# Altium schematic sheet Connectors_U_B.SchDoc
size A4; SheetNumber: 2; SheetTotal: 4
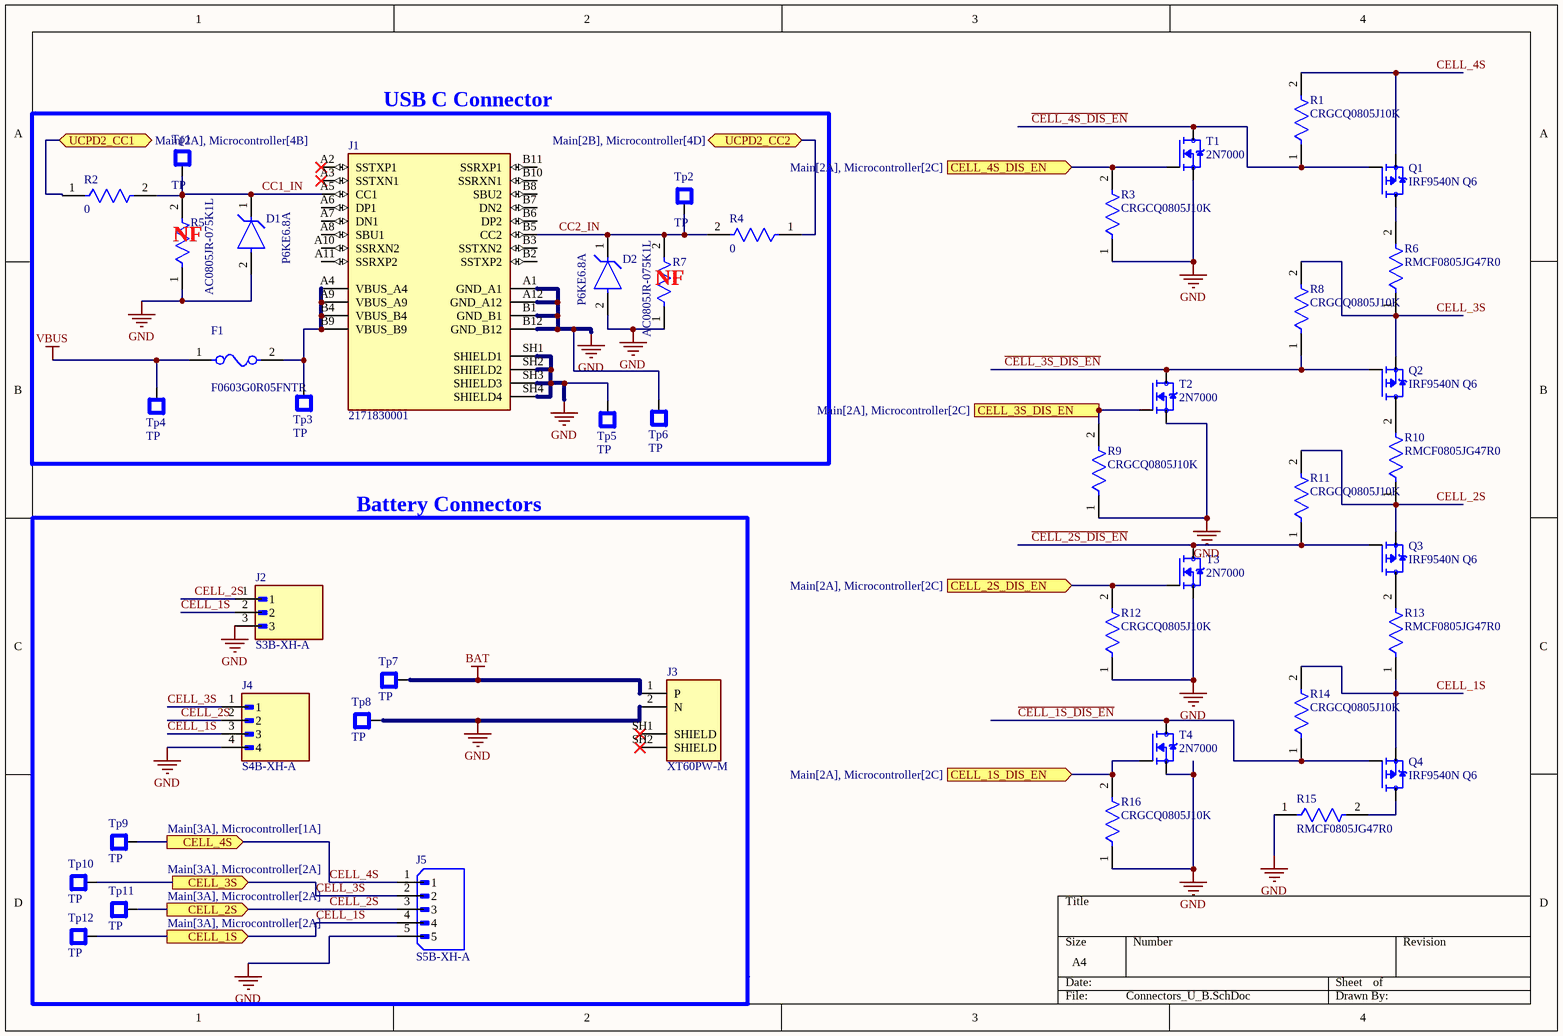
[diagram p0: Connectors_U_B.SchDoc]

## Parts
D1  P6KE6.8A  [FP-P6KE-MFG]
D2  P6KE6.8A  [FP-P6KE-MFG]
F1  F0603G0R05FNTR  [FP-F0603G-MFG]
J1  2171830001  [MOLEX_2171830001]
J2  S3B-XH-A  [JST_S3B-XH-A]
J3  XT60PW-M  [AMASS_XT60PW-M]
J4  S4B-XH-A  [JST_S4B-XH-A]
J5  S5B-XH-A  [JST_S5B-XH-A]
Q1  IRF9540N Q6  [TO254P1041X444X1930-3]
Q2  IRF9540N Q6  [TO254P1041X444X1930-3]
Q3  IRF9540N Q6  [TO254P1041X444X1930-3]
Q4  IRF9540N Q6  [TO254P1041X444X1930-3]
R1  CRGCQ0805J10K  [FP-CRGCQ0805-IPC_C]
R2  0  [FP-HCJ0805-MFG]
R3  CRGCQ0805J10K  [FP-CRGCQ0805-IPC_C]
R4  0  [FP-HCJ0805-MFG]
R5  AC0805JR-075K1L  [FP-AC0805-MFG]
R6  RMCF0805JG47R0  [FP-RMCF0805-MFG]
R7  AC0805JR-075K1L  [FP-AC0805-MFG]
R8  CRGCQ0805J10K  [FP-CRGCQ0805-IPC_C]
R9  CRGCQ0805J10K  [FP-CRGCQ0805-IPC_C]
R10  RMCF0805JG47R0  [FP-RMCF0805-MFG]
R11  CRGCQ0805J10K  [FP-CRGCQ0805-IPC_C]
R12  CRGCQ0805J10K  [FP-CRGCQ0805-IPC_C]
R13  RMCF0805JG47R0  [FP-RMCF0805-MFG]
R14  CRGCQ0805J10K  [FP-CRGCQ0805-IPC_C]
R15  RMCF0805JG47R0  [FP-RMCF0805-MFG]
R16  CRGCQ0805J10K  [FP-CRGCQ0805-IPC_C]
T1  2N7000  [TO92]
T2  2N7000  [TO92]
T3  2N7000  [TO92]
T4  2N7000  [TO92]
Tp1  TP  [Tp]
Tp2  TP  [Tp]
Tp3  TP  [Tp]
Tp4  TP  [Tp]
Tp5  TP  [Tp]
Tp6  TP  [Tp]
Tp7  TP  [Tp]
Tp8  TP  [Tp]
Tp9  TP  [Tp]
Tp10  TP  [Tp]
Tp11  TP  [Tp]
Tp12  TP  [Tp]

## Ports
CELL_1S (out, see Main[3A], Microcontroller[2A]), CELL_1S_DIS_EN (in, see Main[2A], Microcontroller[2C]), CELL_2S (out, see Main[3A], Microcontroller[2A]), CELL_2S_DIS_EN (in, see Main[2A], Microcontroller[2C]), CELL_3S (out, see Main[3A], Microcontroller[2A]), CELL_3S_DIS_EN (in, see Main[2A], Microcontroller[2C]), CELL_4S (out, see Main[3A], Microcontroller[1A]), CELL_4S_DIS_EN (in, see Main[2A], Microcontroller[2C]), UCPD2_CC1 (bidir, see Main[2A], Microcontroller[4B]), UCPD2_CC2 (bidir, see Main[2B], Microcontroller[4D])

## Nets
BAT: J3.1(P) Tp7.1
GND: D1.2(A) D2.2(A) J1.A1(GND_A1) J1.A12(GND_A12) J1.B1(GND_B1) J1.B12(GND_B12) J1.SH1(SHIELD1) J1.SH2(SHIELD2) J1.SH3(SHIELD3) J1.SH4(SHIELD4) J2.3 J3.2(N) J4.4 J5.5 R3.1 R5.1 R7.1 R9.1 R12.1 R15.1 R16.1 T1.1(S) T2.1(S) T3.1(S) T4.1(S) Tp5.1 Tp6.1 Tp8.1
VBUS: F1.1 Tp4.1
~{CELL_1S_DIS_EN}: Q4.1(G) R14.1 T4.3(D)
~{CELL_2S_DIS_EN}: Q3.1(G) R11.1 T3.3(D)
~{CELL_3S_DIS_EN}: Q2.1(G) R8.1 T2.3(D)
~{CELL_4S_DIS_EN}: Q1.1(G) R1.1 T1.3(D)
CC1_IN: D1.1(C) J1.A5(CC1) R2.2 R5.2 Tp1.1
CC2_IN: D2.1(C) J1.B5(CC2) R4.2 R7.2 Tp2.1
CELL_1S: J2.2 J4.3 J5.4 Q4.3(S) R13.1 R14.2 Tp12.1 ; port CELL_1S
CELL_1S_DIS_EN: R16.2 T4.2(G) ; port CELL_1S_DIS_EN
CELL_2S: J2.1 J4.2 J5.3 Q3.3(S) R10.1 R11.2 Tp11.1 ; port CELL_2S
CELL_2S_DIS_EN: R12.2 T3.2(G) ; port CELL_2S_DIS_EN
CELL_3S: J4.1 J5.2 Q2.3(S) R6.1 R8.2 Tp10.1 ; port CELL_3S
CELL_3S_DIS_EN: R9.2 T2.2(G) ; port CELL_3S_DIS_EN
CELL_4S: J5.1 Q1.3(S) R1.2 Tp9.1 ; port CELL_4S
CELL_4S_DIS_EN: R3.2 T1.2(G) ; port CELL_4S_DIS_EN
UCPD2_CC1: R2.1 ; port UCPD2_CC1
UCPD2_CC2: R4.1 ; port UCPD2_CC2
NetF1_2: F1.2 J1.A4(VBUS_A4) J1.A9(VBUS_A9) J1.B4(VBUS_B4) J1.B9(VBUS_B9) Tp3.1
NetQ1_2: Q1.2(D) R6.2
NetQ2_2: Q2.2(D) R10.2
NetQ3_2: Q3.2(D) R13.2
NetQ4_2: Q4.2(D) R15.2

Not connected (* = marked no-connect by the designer): J1 A2(SSTXP1)* A3(SSTXN1)* A6(DP1) A7(DN1) A8(SBU1) A10(SSRXN2) A11(SSRXP2) B2(SSTXP2) B3(SSTXN2) B6(DP2) B7(DN2) B8(SBU2) B10(SSRXN1) B11(SSRXP1); J3 SH1(SHIELD)* SH2(SHIELD)*

## Notes on the sheet
- USB C Connector
- (near R5) NF
- (near R7) NF
- Battery Connectors

## Library data of the parts
D1 D2 = CMP-08607-000072-1: TVS DIODE 5.8V 10.5V DO204AC; Manufacturer: Littelfuse Inc; Peak Pulse Power: 600W; Max Junction Temp: +175°C; Peak Pulse Current: 58.1A; Number Of Channels: 1; Direction: Unidirectional; Breakdown Voltage: 6.45V; Mouser Description: TVSS; Diode; For Data/Comm; Industrial Equip; 58.1A; Thru-Hole; Solder Term; Height: 3.6mm; RoHS: TRUE; Lead Free: Yes; Category: Diode; ComponentLink2Description: Datasheet; Manufacturer Part Number: P6KE6.8A; Package: P6KE; Temperature Range Low: -55°C; Device Class L3: unset; Digikey Description: TVS DIODE 5.8V 10.5V DO204AC; Temperature Range High: +175°C; Automotive: No; Clamping Voltage: 10.5V; Ipc Land Pattern Name: DIOPA1328W105L760D360; Octopart: https://octopart.com/p6ke6.8a-littelfuse-20808; ComponentLink2URL: https://www.littelfuse.com/~/media/electronics/datasheets/tvs_diodes/littelfuse_tvs_diode_p6ke_datasheet.pdf.pdf; Temperature: -55°C to +175°C; Device Class L2: TVS Diodes; Device Class L1: Circuit Protection; Reverse Standoff Voltage: 5.8V
F1 = CMP-04585-000004-1: FUSE BOARD MOUNT 50MA 32VDC 0603; Manufacturer: AVX Corporation; Voltage Rating: 32V; Fuse I2T: 0.000002A2Sec; Fuse Current: 0.125A; Fuse Voltage Drop: 250mV; Fuse Blow Speed: Fast; Value: 3.4Ω; ComponentLink2URL: http://datasheets.avx.com/AccuGuardLC_0603.pdf; Digikey Description: FUSE BOARD MOUNT 50MA 32VDC 0603; Lead Free: Yes; Temperature: -55°C to +125°C; Device Class L2: Fuses; Device Class L1: Circuit Protection; ComponentLink2Description: Datasheet; Category: Fuse; Package: F0603G; Height: 0.71mm; Mouser Description: Fuse Chip 0.05A 32V Fast 2-Pin Solder Pad Surface Mount T/R; Device Class L3: unset; Temperature Range High: +125°C; Temperature Range Low: -55°C; Octopart: https://octopart.com/f0603g0r05fntr-avx-21046321; Resistance: 3.4Ω; RoHS: TRUE; Manufacturer Part Number: F0603G0R05FNTR; Automotive: No
J1 = 2171830001: MF: {'manufacturer': u'Molex'}; Package: None; Price: None; Value: *; MP: 2171830001; Availability: Unavailable
J3 = XT60PW-M: Socket, DC supply, male, PIN: 2; MF: AMASS; SnapEDA_Link: https://www.snapeda.com/parts/XT60PW-M/AMASS/view-part/?ref=snap; Package: Package; Value: *; MP: XT60PW-M; Check_prices: https://www.snapeda.com/parts/XT60PW-M/AMASS/view-part/?ref=eda
J5 = S5B-XH-A: Connector Header Through Hole, Right Angle 5 position 0.098 (2.50mm); MF: JST Sales; SnapEDA_Link: https://www.snapeda.com/parts/S5B-XH-A/JST+Sales+America+Inc./view-part/?ref=snap; Package: None; Value: *; MP: S5B-XH-A; Check_prices: https://www.snapeda.com/parts/S5B-XH-A/JST+Sales+America+Inc./view-part/?ref=eda
Q1-Q4 = IRF9540N Q6: P-Channel 100 V 23A (Tc) 3.1W (Ta), 110W (Tc); MF: Infineon Technologies; Value: *; Purchase-URL: https://pricing.snapeda.com/search/part/IRF9540N/?ref=eda; Package: TO-220 Infineon; MP: IRF9540N; Check_prices: https://www.snapeda.com/parts/IRF9540N/Infineon+Technologies/view-part/?ref=eda; SnapEDA_Link: https://www.snapeda.com/parts/IRF9540N/Infineon+Technologies/view-part/?ref=snap; Price: None; Availability: In Stock
R1 R3 R8 R9 R11 R12 R14 R16 = CMP-03211-002989-1: CRGCQ 0805 10K 5%; Manufacturer: TE Connectivity; Voltage Rating: 150V; Temperature Coefficient: ±100ppm/°C; Resistance: 10KΩ; Value: 10KΩ; Power Rating: 0.125W; Tolerance: 0.05; Automotive Grade: Grade 914; Height: 0.65mm; Lead Free: Yes; Temperature Range High: +155°C; Composition: Thick Film; Temperature Range Low: -55°C; Ambient Temperature Range High: +70°C; Temperature: -55°C to +155°C; Package: CRGCQ0805; Device Class L2: Resistors; RoHS: TRUE; ComponentLink2URL: https://www.te.com/commerce/DocumentDelivery/DDEController?Action=showdoc&DocId=Data+Sheet%7F1773204-3%7F1%7Fpdf%7FEnglish%7FENG_DS_1773204-3_1.pdf%7F4-2176341-923; Manufacturer Part Number: CRGCQ0805J10K; Series: CRGCQ; Device Class L1: Passive Components; Ipc Land Pattern Name: RESC200125X55; ComponentLink2Description: Datasheet; Category: Res; Digikey Description: CRGCQ 0805 10K 5%; Mouser Description: Res Thick Film 0805 10K Ohm 5% 0.125W(1/8W) ±100ppm/C Pad SMD Automotive T/R; Automotive: Yes; Octopart: https://octopart.com/crgcq0805j10k-te+connectivity-91018201; Device Class L3: Chip SMD Resistors
R2 R4 = CMP-26527-000104-1: RES 0 OHM JUMPER 1/2W 0805; Resistance: 0mR; Radiation Hardening: No; Case Code (Imperial): 0805; Number of Terminations: 2; Lead Free: Lead Free; Max Operating Temperature: 155°C; Width: 0.049inch; Case Code (Metric): 2012; Height: 0.026inch; Mount: Surface Mount; Min Operating Temperature: -55°C; Packaging: Tape and Reel; Package Quantity: 1; Termination: Wraparound; Length: 0.079inch; RoHS Compliant: Yes; Case/Package: 0805
R5 R7 = CMP-2001-04477-2: RES SMD 5.1K OHM 5% 1/8W 0805; Manufacturer: Yageo; Automotive Grade: Grade 0; Value: 5.1KΩ; Voltage Rating: 150V; Tolerance: 0.05; Category: Res; RoHS: TRUE; Automotive: Yes; Device Class L1: Passive Components; Lead Free: Yes; Octopart: https://octopart.com/ac0805jr-075k1l-yageo-21711115; Series: AC; Temperature Range High: +155°C; ComponentLink2URL: http://www.yageo.com/documents/recent/PYu-AC_51_RoHS_L_6.pdf; Temperature Range Low: -55°C; ComponentLink2Description: Datasheet; Footprint Url: http://www.yageo.com/exep/pages/download/literatures/PYu-R_Mount_10.pdf; Mouser Description: Thick Film Resistors - SMD 5.1K ohm 5% 1/8W; Device Class L3: Chip SMD Resistors; Digikey Description: RES SMD 5.1K OHM 5% 1/8W 0805; Power Rating: 1/8W; Package: AC0805; Temperature: -55°C to +155°C; Device Class L2: Resistors; Resistance: 5.1KΩ; Height: 0.6mm; Manufacturer Part Number: AC0805JR-075K1L; Ipc Land Pattern Name: RESC200125X50; Composition: Thick Film
R6 R10 R13 R15 = CMP-26527-004456-1: 47Ω ±5% 0.125W 0805 Thick Film Chip Resistor AEC-Q200 compliant; Max Power Dissipation: 125mW; Resistance: 47R; Temperature Coefficient: 200ppm/°C; Packaging: Tape and Reel; Case Code (Metric): 2012; Mount: Surface Mount; Min Operating Temperature: -55°C; Package Quantity: 10000; Length: 0.079inch; Number of Terminations: 2; RoHS Compliant: Yes; Max Operating Temperature: 155°C; Case/Package: 0805; Height: 0.026inch; Radiation Hardening: No; Resistor Type: Thick Film; Contact Plating: Tin; Width: 0.049inch; Case Code (Imperial): 0805; Series: RMCF; Features: Automotive AEC-Q200; Tolerance: 5%
T1-T4 = 2N7000: N-Channel 60 V 200mA (Ta) 400mW (Ta) Through Hole TO-92-3; MF: onsemi; SnapEDA_Link: https://www.snapeda.com/parts/2N7000/Onsemi/view-part/?ref=snap; Package: E-PKG AXIAL-LEADED-2 ON Semiconductor; Value: *; MP: 2N7000; Check_prices: https://www.snapeda.com/parts/2N7000/Onsemi/view-part/?ref=eda
J2 = S3B-XH-A: Package: None; Price: None; Value: *; MP: S3B-XH-A; Availability: Unavailable
J4 = S4B-XH-A: Package: None; Price: None; Value: *; MP: S4B-XH-A; Availability: Unavailable